# EAGLE design Un_TTL (EAGLE 7.5.0)
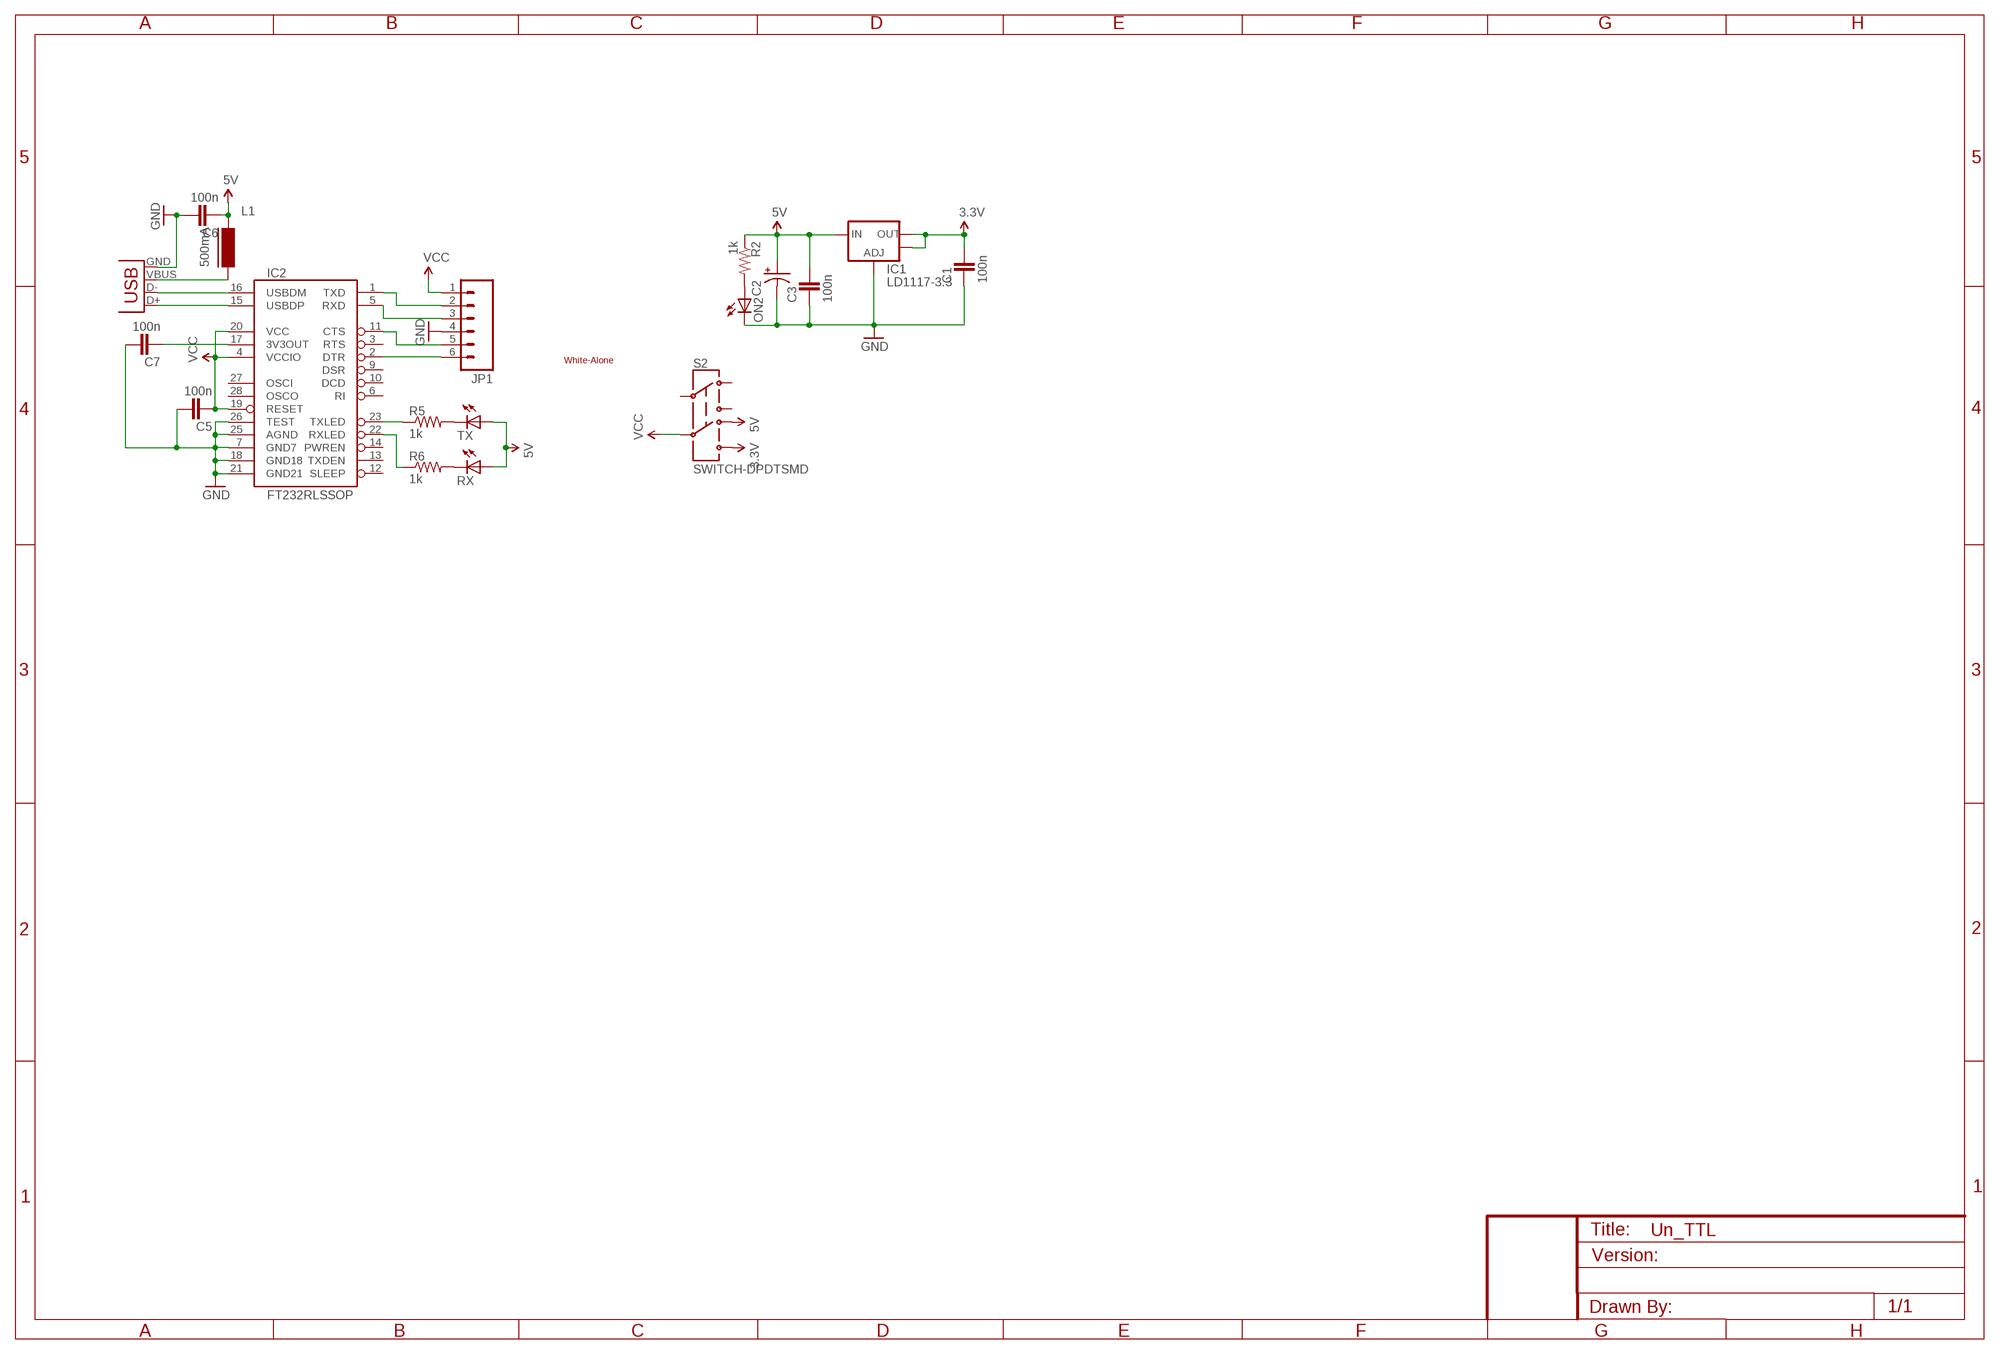
[diagram p0: schematic, sheet 1]

## Parts
C1  100n  CAP0603  [0603-CAP]
C2  CAP_POL1206  [EIA3216]
C3  100n  CAP0603  [0603-CAP]
C5  100n  CAP0603  [0603-CAP]
C6  100n  CAP0603  [0603-CAP]
C7  100n  CAP0603  [0603-CAP]
IC1  LD1117-3.3  V_REG_LM1117SOT223  [SOT223]
IC2  FT232RLSSOP  [SSOP28DB]
JP1  M06SIP  [1X06]
L1  500mA  FERRITE-0805  [FB805]
ON2  LED0805  [LED-0805]
R2  1k  RESISTOR0603-RES  [0603-RES]
R5  1k  RESISTOR0603-RES  [0603-RES]
R6  1k  RESISTOR0603-RES  [0603-RES]
RX  LED0805  [LED-0805]
S2  SWITCH-DPDTSMD  [AYZ0202]
TX  LED0805  [LED-0805]
U$2  WHITE-ALONE_0  [WHITE-ALONE_0]
X1  USBSMD  [USB-MINIB]

## Nets
3.3V: C1.1 IC1.2(OUT) IC1.4(OUT) S2.6
5V [usbvcc]: C2.A(+) C3.1 C6.2 IC1.3(IN) L1.1 R2.1 RX.1(A) S2.4 TX.1(A)
DTR: IC2.11(CTS) JP1.5
GND [gnd]: C1.2 C2.C(-) C3.2 C5.1 C6.1 C7.1 IC1.1(ADJ) IC2.7(GND7) IC2.18(GND18) IC2.21(GND21) IC2.25(AGND) IC2.26(TEST) JP1.4 ON2.2(C) X1.GND
N$2: ON2.1(A) R2.2
N$3: L1.2 X1.VBUS
N$4: IC2.2(DTR) JP1.6
N$5: IC2.16(USBDM) X1.D-
N$6: IC2.15(USBDP) X1.D+
N$7: IC2.23(TXLED) R5.1
N$8: R5.2 TX.2(C)
N$9: R6.2 RX.2(C)
N$10: IC2.22(RXLED) R6.1
N$22: C7.2 IC2.17(3V3OUT)
RXD: IC2.5(RXD) JP1.3
TXD: IC2.1(TXD) JP1.2
VCC: C5.2 IC2.4(VCCIO) IC2.19(RESET) IC2.20(VCC) JP1.1 S2.5
Unconnected: IC2.3(RTS) IC2.6(RI) IC2.9(DSR) IC2.10(DCD) IC2.12(SLEEP) IC2.13(TXDEN) IC2.14(PWREN) IC2.27(OSCI) IC2.28(OSCO) S2.1 S2.2 S2.3

## Library data of the parts
C1 C3 C5-C7 = 2SparkFun:CAP: Capacitor Standard 0603 ceramic capacitor, and 0.1" leaded capacitor.
C2 = 2SparkFun:CAP_POL: Capacitor Polarized These are standard SMD and PTH capacitors. Normally 10uF, 47uF, and 100uF in electrolytic and tantalum varieties. Always verify the external diameter of the through hole cap, it varies with capacity, voltage, and manufacturer. The EIA devices should be standard.
IC1 = 1SparkFun:V_REG_LM1117: Voltage Regulator LM1117 Standard adjustable voltage regulator but in SMD form. Spark Fun Electronics SKU : COM-00595
IC2 = 1SparkFun:FT232RL: USB UART FT232RL 4th Generation USB UART (USB <-> Serial) Controller. Spark Fun Electronics SKU : COM-00650
JP1 = 2SparkFun:M06: Header 6 Standard 6-pin 0.1" header. Use with straight break away headers (SKU : PRT-00116), right angle break away headers (PRT-00553), swiss pins (PRT-00743), machine pins (PRT-00117), and female headers (PRT-00115). Molex polarized connector foot print use with SKU : PRT-08094 with associated crimp pins and housings. NOTES ON THE VARIANTS LOCK and LOCK_LONGPADS... This footprint was designed to help hold the alignment of a through-hole component (i.e. 6-pin header) while soldering it into place. You may notice that each hole has been shifted either up or down by 0.005 of an inch from it's more standard position (which is a perfectly straight line). This slight alteration caused the pins (the squares in the middle) to touch the edges of the holes. Because they are alternating, it causes a "brace" to hold the component in place. 0.005 has proven to be the perfect amount of "off-center" position when using our standard breakaway headers. Although looks a little odd when you look at the bare footprint, once you have a header in there, the alteration is very hard to notice. Also, if you push a header all the way into place, it is covered up entirely on the bottom side. This idea of altering the position of holes to aid alignment will be further integrated into the Sparkfun Library for other footprints. It can help hold any component with 3 or more connection pins.
L1 = 2SparkFun:FERRITE: Ferrite bead in various packages
ON2 RX TX = 1SparkFun:LED: LEDs Standard schematic elements and footprints for 5mm, 3mm, 1206, and 0603 sized LEDs. 5mm - Spark Fun Electronics SKU : COM-00529 (and others)
R2 R5 R6 = 2SparkFun:RESISTOR: Resistor Basic schematic elements and footprints for 0603, 1206, and PTH resistors.
S2 = 2SparkFun:SWITCH-DPDT: DPDT Version of the COM-00597
U$2 = 2SparkFun:WHITE-ALONE
X1 = 1SparkFun:USB: USB Connectors USB-B-PTH is fully proven SKU : PRT-00139 USB-miniB is fully proven SKU : PRT-00587 USB-A-PCB is untested. USB-A-H is throughly reviewed, but untested. Spark Fun Electronics SKU : PRT-00437 USB-B-SMT is throughly reviewed, but untested. Needs silkscreen touching up. USB-A-S has not been used/tested USB-MB-H has not been used/tested

## Net classes
0 default: width 0.254 mm, clearance 0.254 mm
1 power: width 0.61 mm, drill 0.61 mm, clearance 0.254 mm
2 gnd: width 0.305 mm, drill 0.381 mm, clearance 0.254 mm
3 usbvcc: width 0.508 mm, drill 0.61 mm, clearance 0.254 mm
4 aref: width 0.406 mm, drill 0.61 mm, clearance 0.254 mm

## Board
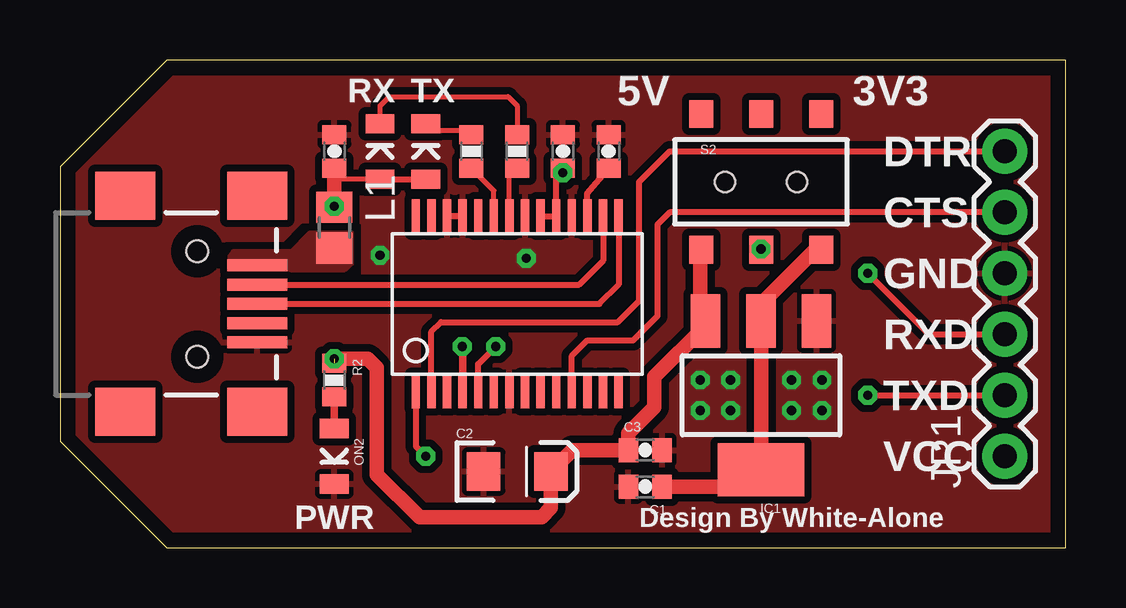
[diagram p1: board, top side]
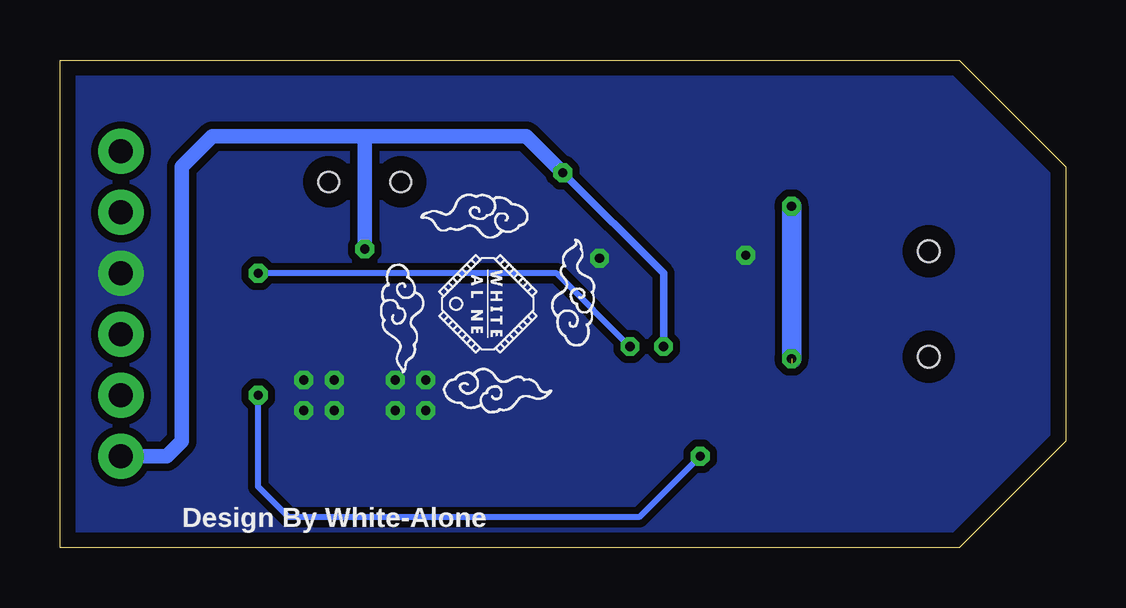
[diagram p2: board, bottom side, seen from below]

Size 41.91 x 20.32 mm. Coordinates in mm from the lower left corner, seen from the top.
Outline: 41.91,0 41.91,20.32 4.44,20.32 0,15.88 0,4.45 4.44,0 41.91,0
Copper layers (1*16): Top 0.035mm / dielectric 1.5mm / Bottom 0.035mm
Design rules "yun": minimum track width 8mil, minimum drill 15mil, track to track 8mil, track to pad 8mil, pad to pad 8mil, via to via 8mil, smd to smd 8mil, copper to edge 25mil, drill to drill 8mil, minimum pad ring 10mil, minimum via ring 8mil, stop-mask expansion 4mil, vias tented up to drill 20mil, thermal gap 8mil

### Footprints (pad centres in the part's own frame; a part is rotated, then mirrored left to right if it is on the bottom)
0603-CAP = smd 0.8 x 1: 1 -0.7,0; 2 0.7,0
EIA3216 = smd 1.4 x 1.6: A 1.4,0; C -1.4,0
SOT223 = smd 1.219 x 2.235: 1 -2.311,-3.099; 2 0,-3.099; 3 2.311,-3.099 | smd 3.6 x 2.2: 4 0,3.099
SSOP28DB = smd 0.348 x 1.397: 1 -4.225,-3.656; 2 -3.575,-3.656; 3 -2.925,-3.656; 4 -2.275,-3.656; 5 -1.625,-3.656; 6 -0.975,-3.656; 7 -0.325,-3.656; 8 0.325,-3.656; 9 0.975,-3.656; 10 1.625,-3.656; 11 2.275,-3.656; 12 2.925,-3.656; 13 3.575,-3.656; 14 4.225,-3.656; 15 4.225,3.656; 16 3.575,3.656; 17 2.925,3.656; 18 2.275,3.656; 19 1.625,3.656; 20 0.975,3.656; 21 0.325,3.656; 22 -0.325,3.656; 23 -0.975,3.656; 24 -1.625,3.656; 25 -2.275,3.656; 26 -2.925,3.656; 27 -3.575,3.656; 28 -4.225,3.656
1X06 = drill 1 pad 1.88: 1 0,0; 2 2.54,0; 3 5.08,0; 4 7.62,0; 5 10.16,0; 6 12.7,0
FB805 = smd 1.3 x 1.5: 1 -0.85,0; 2 0.85,0
LED-0805 = smd 0.8 x 1.2: 1 -1.154,0; 2 1.154,0
0603-RES = smd 0.8 x 1: 1 -0.7,0; 2 0.7,0
AYZ0202 = smd 1 x 1.15: 1 -2.5,2.825; 2 0,2.825; 3 2.5,2.825; 4 -2.5,-2.825; 5 0,-2.825; 6 2.5,-2.825 | hole 0.85: 1.5,0; -1.5,0
USB-MINIB = smd 2.5 x 0.5: D+ 2.5,0; D- 2.5,0.8; GND 2.5,-1.6; ID 2.5,-0.8; VBUS 2.5,1.6 | smd 2.5 x 2: GND@1 -3,-4.5; GND@2 -3,4.5; GND@3 2.5,4.5; GND@4 2.5,-4.5 | hole 0.9: 0,2.2; 0,-2.2

### Placement (x,y rotation side)
C1  24.38,2.54 180 top
C2  19.05,3.17 0 top
C3  24.38,4.06 0 top
C5  20.95,16.51 270 top
C6  11.43,16.51 270 top
C7  22.86,16.51 270 top
IC1  29.21,6.35 180 top
IC2  19.05,10.16 0 top
JP1  39.37,3.81 90 top
L1  11.43,13.33 270 top
ON2  11.43,3.81 270 top
R2  11.43,6.98 270 top
R5  17.14,16.51 90 top
R6  19.05,16.51 90 top
RX  13.33,16.51 90 top
S2  29.21,15.24 0 top
TX  15.24,16.51 90 top
U$2  24.13,10.16 270 bottom
X1  5.72,10.16 0 top

### Tracks (layer width: path | path; a pad name or v marks a point on that pad's centre or on a via)
3.3V
  Top 0.61: S2.6 31.47,12.41 29.21,10.16 IC1.2 IC1.4 28.5,2.54 C1.1 25.11,2.54
5V  (via drill 0.38)  (1 unrouted)
  Top 0.203: RX.1 11.55,15.36 11.43,15.24
  Top 0.254: RX.1 TX.1
  Top 0.305: S2.4 26.71,12.11 26.67,12.06
  Top 0.61: 26.67,12.06 26.67,9.68 IC1.3 26.9,9.25 24.77,7.11 24.77,5.84 23.68,4.76 C3.1 21.34,4.06 C2.A 20.45,1.65 20.07,1.27 14.99,1.27 13.21,3.05 13.21,7.49 12.83,7.87 v11.43,7.87 | C6.2 11.43,15.24 v11.43,14.22 L1.1
  Bottom 0.813: v11.43,14.22 v11.43,7.87
DTR
  Top 0.254: JP1.5 25.4,13.97 24.89,13.46 24.89,9.65 23.88,8.64 21.97,8.64 21.33,7.99 IC2.11
GND  (via drill 0.38)
  Top 0.254: IC2.25 IC2.26
  other vias: 30.48,6.98 31.75,6.98 30.48,5.71 31.75,5.71 27.94,5.71 27.94,6.98 26.67,5.71 26.67,6.98 19.43,12.06 13.33,12.19
  pour Bottom (isolate 0.305, rank 2, no thermals): 0,0 41.91,0 41.91,20.32 0,20.32
  pour Top (isolate 0.305, rank 2): 0,0 41.91,0 41.91,20.32 0,20.32
N$2
  Top 0.305: R2.2 ON2.1
N$3
  pour Top (isolate 0.305, no thermals): 7.09,11.61 11.86,11.61 12.14,11.86 12.14,13.08 10.41,13.08 9.65,12.32 7.24,12.32 7.09,12.12
N$4
  Top 0.254: IC2.2 15.47,9 15.88,9.4 23.24,9.4 24.13,10.29 24.13,15.24 25.4,16.51 JP1.6
N$5
  Top 0.254: IC2.16 22.62,11.96 21.63,10.96 X1.D-
N$6
  Top 0.254: X1.D+ 22.48,10.16 23.28,10.96 IC2.15
N$7
  Top 0.203: IC2.23 18.08,14.88 R5.1
N$8
  Top 0.203: TX.2 15.5,17.4 16.96,17.4 R5.2
N$9
  Top 0.203: RX.2 13.33,18.41 13.72,18.8 18.67,18.8 19.05,18.41 R6.2
N$10
  Top 0.203: IC2.22 18.72,15.48 R6.1
N$22
  Top 0.254: IC2.17 21.97,14.77 C7.2
RXD  (via drill 0.38)
  Top 0.254: IC2.5 17.42,7.65 v18.16,8.38 | v33.66,11.43 36.19,8.89 JP1.3
  Bottom 0.254: v18.16,8.38 21.21,11.43 v33.66,11.43
TXD  (via drill 0.38)
  Top 0.254: v33.66,6.35 JP1.2 | IC2.1 14.83,4.22 v15.24,3.81
  Bottom 0.254: v33.66,6.35 33.66,2.54 32.39,1.27 17.78,1.27 v15.24,3.81
VCC  (via drill 0.38)
  Top 0.254: IC2.20 IC2.19 20.67,15.38 C5.2
  Top 0.305: IC2.4 16.78,8.37 v16.76,8.38
  Top 0.61: C5.2 v20.95,15.62 | S2.5 v29.21,12.45
  Bottom 0.305: v16.76,8.38 16.76,11.43 v20.95,15.62
  Bottom 0.61: JP1.1 37.47,3.81 36.83,4.45 36.83,15.88 35.56,17.14 29.21,17.14 | v29.21,12.45 29.21,17.14 | 29.21,17.14 22.48,17.14 v20.95,15.62

### Text on the board
tPlace: RX | TX | 5V | 3V3 | DTR | CTS | GND | RXD | TXD | VCC | PWR | Design By White-Alone
bPlace: Design By White-Alone